# Altium schematic sheet BLE232_main.SchDoc
size A4; SheetNumber: 1; SheetTotal: 1
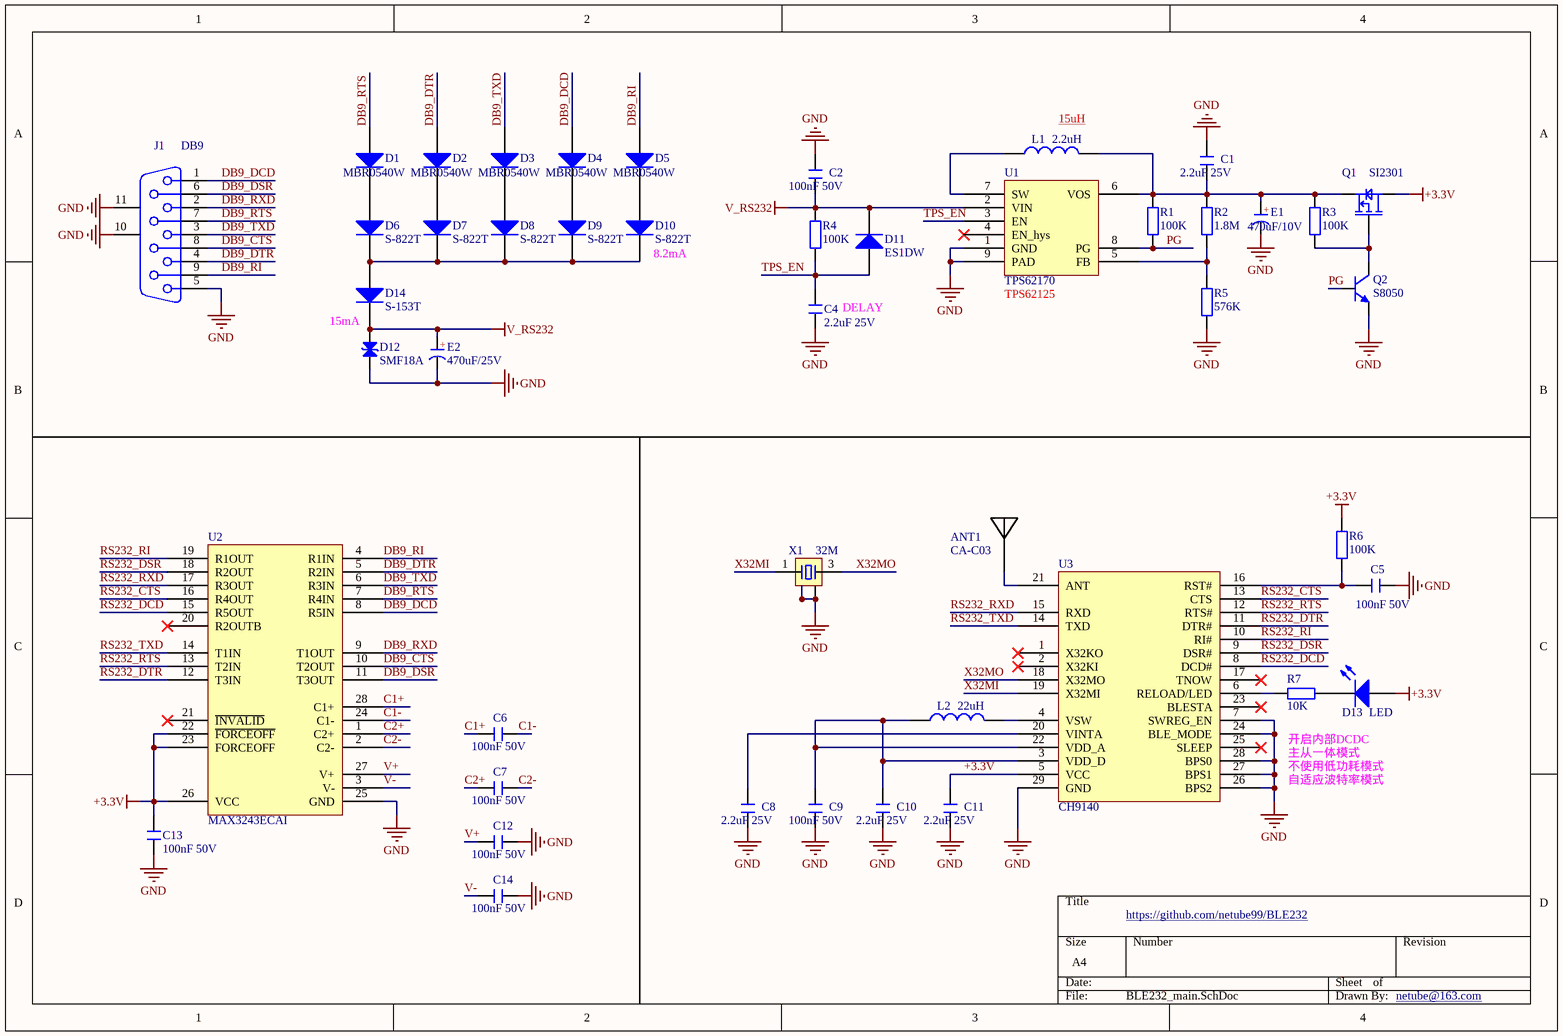
[diagram p0: BLE232_main.SchDoc]

## Parts
ANT1  CA-C03  [CA-C03]
C1  2.2uF 25V  [C 0603_L]
C2  100nF 50V  [C 0603_L]
C4  2.2uF 25V  [C 0603_L]
C5  100nF 50V  [C 0603_L]
C6  100nF 50V  [C 0603_L]
C7  100nF 50V  [C 0603_L]
C8  2.2uF 25V  [C 0603_L]
C9  100nF 50V  [C 0603_L]
C10  2.2uF 25V  [C 0603_L]
C11  2.2uF 25V  [C 0603_L]
C12  100nF 50V  [C 0603_L]
C13  100nF 50V  [C 0603_L]
C14  100nF 50V  [C 0603_L]
D1  MBR0540W  [SOD-123]
D2  MBR0540W  [SOD-123]
D3  MBR0540W  [SOD-123]
D4  MBR0540W  [SOD-123]
D5  MBR0540W  [SOD-123]
D6  S-822T  [SOD-123]
D7  S-822T  [SOD-123]
D8  S-822T  [SOD-123]
D9  S-822T  [SOD-123]
D10  S-822T  [SOD-123]
D11  ES1DW  [SOD-123]
D12  SMF18A  [SOD-123]
D13  LED  [R 0603_L]
D14  S-153T  [SOD-123]
E1  470uF/10V  [CS 2.5*6.3*7 - R]
E2  470uF/25V  [CS 3.5*8*11.5 - R]
J1  DB9  [DB9/S_A]
L1  2.2uH  [NLV25T]
L2  22uH  [NLV25T]
Q1  SI2301  [SOT23-3N]
Q2  S8050  [SOT23-3N]
R1  100K  [R 0603_L]
R2  1.8M  [R 0603_L]
R3  100K  [R 0603_L]
R4  100K  [R 0603_L]
R5  576K  [R 0603_L]
R6  100K  [R 0603_L]
R7  10K  [R 0603_L]
U1  TPS62170  [WSON-8_2X2]
U2  MAX3243ECAI  [SSOP28_N]
U3  CH9140  [QFN28 4*4]
X1  32M  [OSC 1612-4P]

## Nets
+3.3V: C11.1 C13.1 D13.1(A) Q1.3(D) R6.2 U2.22(~{FORCEOFF}) U2.23(FORCEOFF) U2.26(VCC) U3.5(VCC)
GND: C1.1 C2.1 C4.1 C5.2 C8.2 C9.2 C10.2 C11.2 C12.1 C13.2 C14.1 D12.1(A) E1.2(K) E2.2(K) J1.5 J1.10(MH1) J1.11(MH2) Q2.2(E) R5.1 U1.1(GND) U1.9(PAD) U2.25(GND) U3.7(SWREG_EN) U3.24(BLE_MODE) U3.26(BPS2) U3.27(BPS1) U3.28(BPS0) U3.29(GND) X1.2 X1.4
V_RS232: C2.2 D11.2(K) D12.2(K) D14.2(K) E2.1(A) R4.2 U1.2(VIN)
C1+: C6.2 U2.28(C1+)
C1-: C6.1 U2.24(C1-)
C2+: C7.2 U2.1(C2+)
C2-: C7.1 U2.2(C2-)
DB9_CTS: J1.8 U2.10(T2OUT)
DB9_DCD: D4.1(A) J1.1 U2.8(R5IN)
DB9_DSR: J1.6 U2.11(T3OUT)
DB9_DTR: D2.1(A) J1.4 U2.5(R2IN)
DB9_RI: D5.1(A) J1.9 U2.4(R1IN)
DB9_RTS: D1.1(A) J1.7 U2.7(R4IN)
DB9_RXD: J1.2 U2.9(T1OUT)
DB9_TXD: D3.1(A) J1.3 U2.6(R3IN)
PG: Q2.1(B) R1.1 U1.8(PG)
RS232_CTS: U2.16(R4OUT) U3.13(CTS)
RS232_DCD: U2.15(R5OUT) U3.8(DCD#)
RS232_DSR: U2.18(R2OUT) U3.9(DSR#)
RS232_DTR: U2.12(T3IN) U3.11(DTR#)
RS232_RI: U2.19(R1OUT) U3.10(RI#)
RS232_RTS: U2.13(T2IN) U3.12(RTS#)
RS232_RXD: U2.17(R3OUT) U3.15(RXD)
RS232_TXD: U2.14(T1IN) U3.14(TXD)
TPS_EN: C4.2 D11.1(A) R4.1 U1.3(EN)
V+: C12.2 U2.27(V+)
V-: C14.2 U2.3(V-)
X32MI: U3.19(X32MI) X1.1
X32MO: U3.18(X32MO) X1.3
NetANT1_1: ANT1.1 U3.21(ANT)
NetC1_2: C1.2 E1.1(A) L1.2 Q1.2(S) R1.2 R2.2 R3.2 U1.6(VOS)
NetC5_1: C5.1 R6.1 U3.16(RST#)
NetC8_1: C8.1 U3.20(VINTA)
NetC9_1: C9.1 C10.1 L2.1 U3.3(VDD_D) U3.22(VDD_A)
NetD1_2: D1.2(K) D6.1(A)
NetD2_2: D2.2(K) D7.1(A)
NetD3_2: D3.2(K) D8.1(A)
NetD4_2: D4.2(K) D9.1(A)
NetD5_2: D5.2(K) D10.1(A)
NetD6_2: D6.2(K) D7.2(K) D8.2(K) D9.2(K) D10.2(K) D14.1(A)
NetD13_2: D13.2(K) R7.2
NetL1_1: L1.1 U1.7(SW)
NetL2_2: L2.2 U3.4(VSW)
NetQ1_1: Q1.1(G) Q2.3(C) R3.1
NetR2_1: R2.1 R5.2 U1.5(FB)
NetR7_1: R7.1 U3.6(RELOAD/LED)

Not connected (* = marked no-connect by the designer): U1 4(EN_hys)*; U2 20(R2OUTB)* 21(~{INVALID})*; U3 1(X32KO)* 2(X32KI)* 17(TNOW)* 23(BLESTA)* 25(SLEEP)*

## Notes on the sheet
- (near L1) 15uH
- (near D10) 8.2mA
- (near C4) DELAY
- (near U1) TPS62125
- 15mA
- 自适应波特率模式
- 开启内部DCDC
- 主从一体模式
- 不使用低功耗模式
- https://github.com/netube99/BLE232
- netube@163.com
- (in symbol CS) +

## Library data of the parts
ANT1 = ANT1: PCB板载天线; 版权归属: 封装库来自淘宝 ID：黄晶宝石; BOM名称: PCB板载天线; 技术支持，联系售后: https://shop463601444.taobao.com
C1 C2 C4-C14 = C: 贴片电容; BOM名称: 无极性贴片电容; 优秀评价可免费更新: 联系淘宝ID：黄晶宝石，获取更新版封装库; 卖家免费技术支持，联系售后: 唯一出售店铺网址https://shop463601444.taobao.com; 本封装库来自淘宝卖家 ID：黄晶宝石: 其他店铺购入均为盗版，请立即申请退款
D1-D11 D14 = Diode: 二极管; 卖家免费技术支持，联系售后: 唯一出售店铺网址https://shop463601444.taobao.com; 优秀评价可免费更新: 联系淘宝ID：黄晶宝石，获取更新版封装库; 封装库 来自淘宝卖家 ID：黄晶宝石: 其他店铺购入均为盗版，请立即申请退款; Code_JEDEC: DO-214-AB
D12 = TVS: TVS保护; 卖家免费技术支持，联系售后: 唯一出售店铺网址https://shop463601444.taobao.com; 优秀评价可免费更新: 联系淘宝ID：黄晶宝石，获取更新版封装库; 封装库 来自淘宝卖家 ID：黄晶宝石: 其他店铺购入均为盗版，请立即申请退款; Code_JEDEC: DO-214-AB
D13 = LED: 发光二极管; 优秀评价可免费更新: 联系淘宝ID：黄晶宝石，获取更新版封装库; 卖家免费技术支持，联系售后: 唯一出售店铺网址https://shop463601444.taobao.com; 封装库来自淘宝卖家 ID：黄晶宝石: 其他店铺购入均为假冒，请立即申请退款，本店奖励2~5元现金; 技术支持，联系售后: https://shop463601444.taobao.com
E1 E2 = CS: 直插固态电容; 优秀评价可免费更新: 联系淘宝ID：黄晶宝石，获取更新版封装库; 卖家免费技术支持，联系售后: 唯一出售店铺网址https://shop463601444.taobao.com; 本封装库来自淘宝卖家 ID：黄晶宝石: 其他店铺购入均为盗版，请立即申请退款; BOM名称: 直插固态电容
J1 = DB9: 9针串口; BOM名称: 9针串口; 技术支持，联系售后: https://shop463601444.taobao.com
L1 L2 = L: 小功率贴片电感; 优秀评价可免费更新: 联系淘宝ID：黄晶宝石，获取更新版封装库; 卖家免费技术支持，联系售后: 唯一出售店铺网址https://shop463601444.taobao.com; 本封装库来自淘宝卖家 ID：黄晶宝石: 其他店铺购入均为盗版，请立即申请退款; BOM名称: 小功率贴片电感
Q1 = SI2301: P沟道场效应管; 卖家免费技术支持，联系售后: 唯一出售店铺网址https://shop463601444.taobao.com; 封装库来自淘宝卖家 ID：黄晶宝石: 其他店铺购入均为假冒，请申请退款，本店现金奖励; BOM名称: P沟道场效应管
Q2 = 8050-SMD: 高频放大-NPN型; 属性: 40V 1.5A 1W 100MHZ; 卖家免费技术支持，联系售后: 唯一出售店铺网址https://shop463601444.taobao.com; 封装库来自淘宝卖家 ID：黄晶宝石: 其他店铺购入均为假冒，请立即申请退款，本店奖励2~5元现金; BOM名称: 高频放大-NPN型
R1-R7 = R: 贴片电阻; 优秀评价可免费更新: 联系淘宝ID：黄晶宝石，获取更新版封装库; 卖家免费技术支持，联系售后: 唯一出售店铺网址https://shop463601444.taobao.com; 本封装库来自淘宝卖家 ID：黄晶宝石: 其他店铺购入均为盗版，请立即申请退款; BOM名称: 贴片电阻
U1 = TPS62125
X1 = XTAL-4P: 4脚无源晶振; 版权归属: 封装库来自淘宝卖家 ID：黄晶宝石; 优秀评价可免费更新: 联系淘宝ID：黄晶宝石，获取更新版封装库; 卖家免费技术支持，联系售后: 唯一出售店铺网址https://shop463601444.taobao.com; 封装库来自淘宝卖家 ID：黄晶宝石: 其他店铺购入均为盗版，请立即申请退款; BOM名称: 4脚无源晶振